# EasyEDA Pro project keyboard_board_schematic.epro

# Schematic Keyboard_schem
Board Name: Palmanac_keyboard; Create Date: 2025-07-08; Page Name: Palmanac; Project Name: Palmanac; Schematic Name: Keyboard_schem; Update Date: 2025-07-22; File: Palmanac; Id: /; Sheet: /
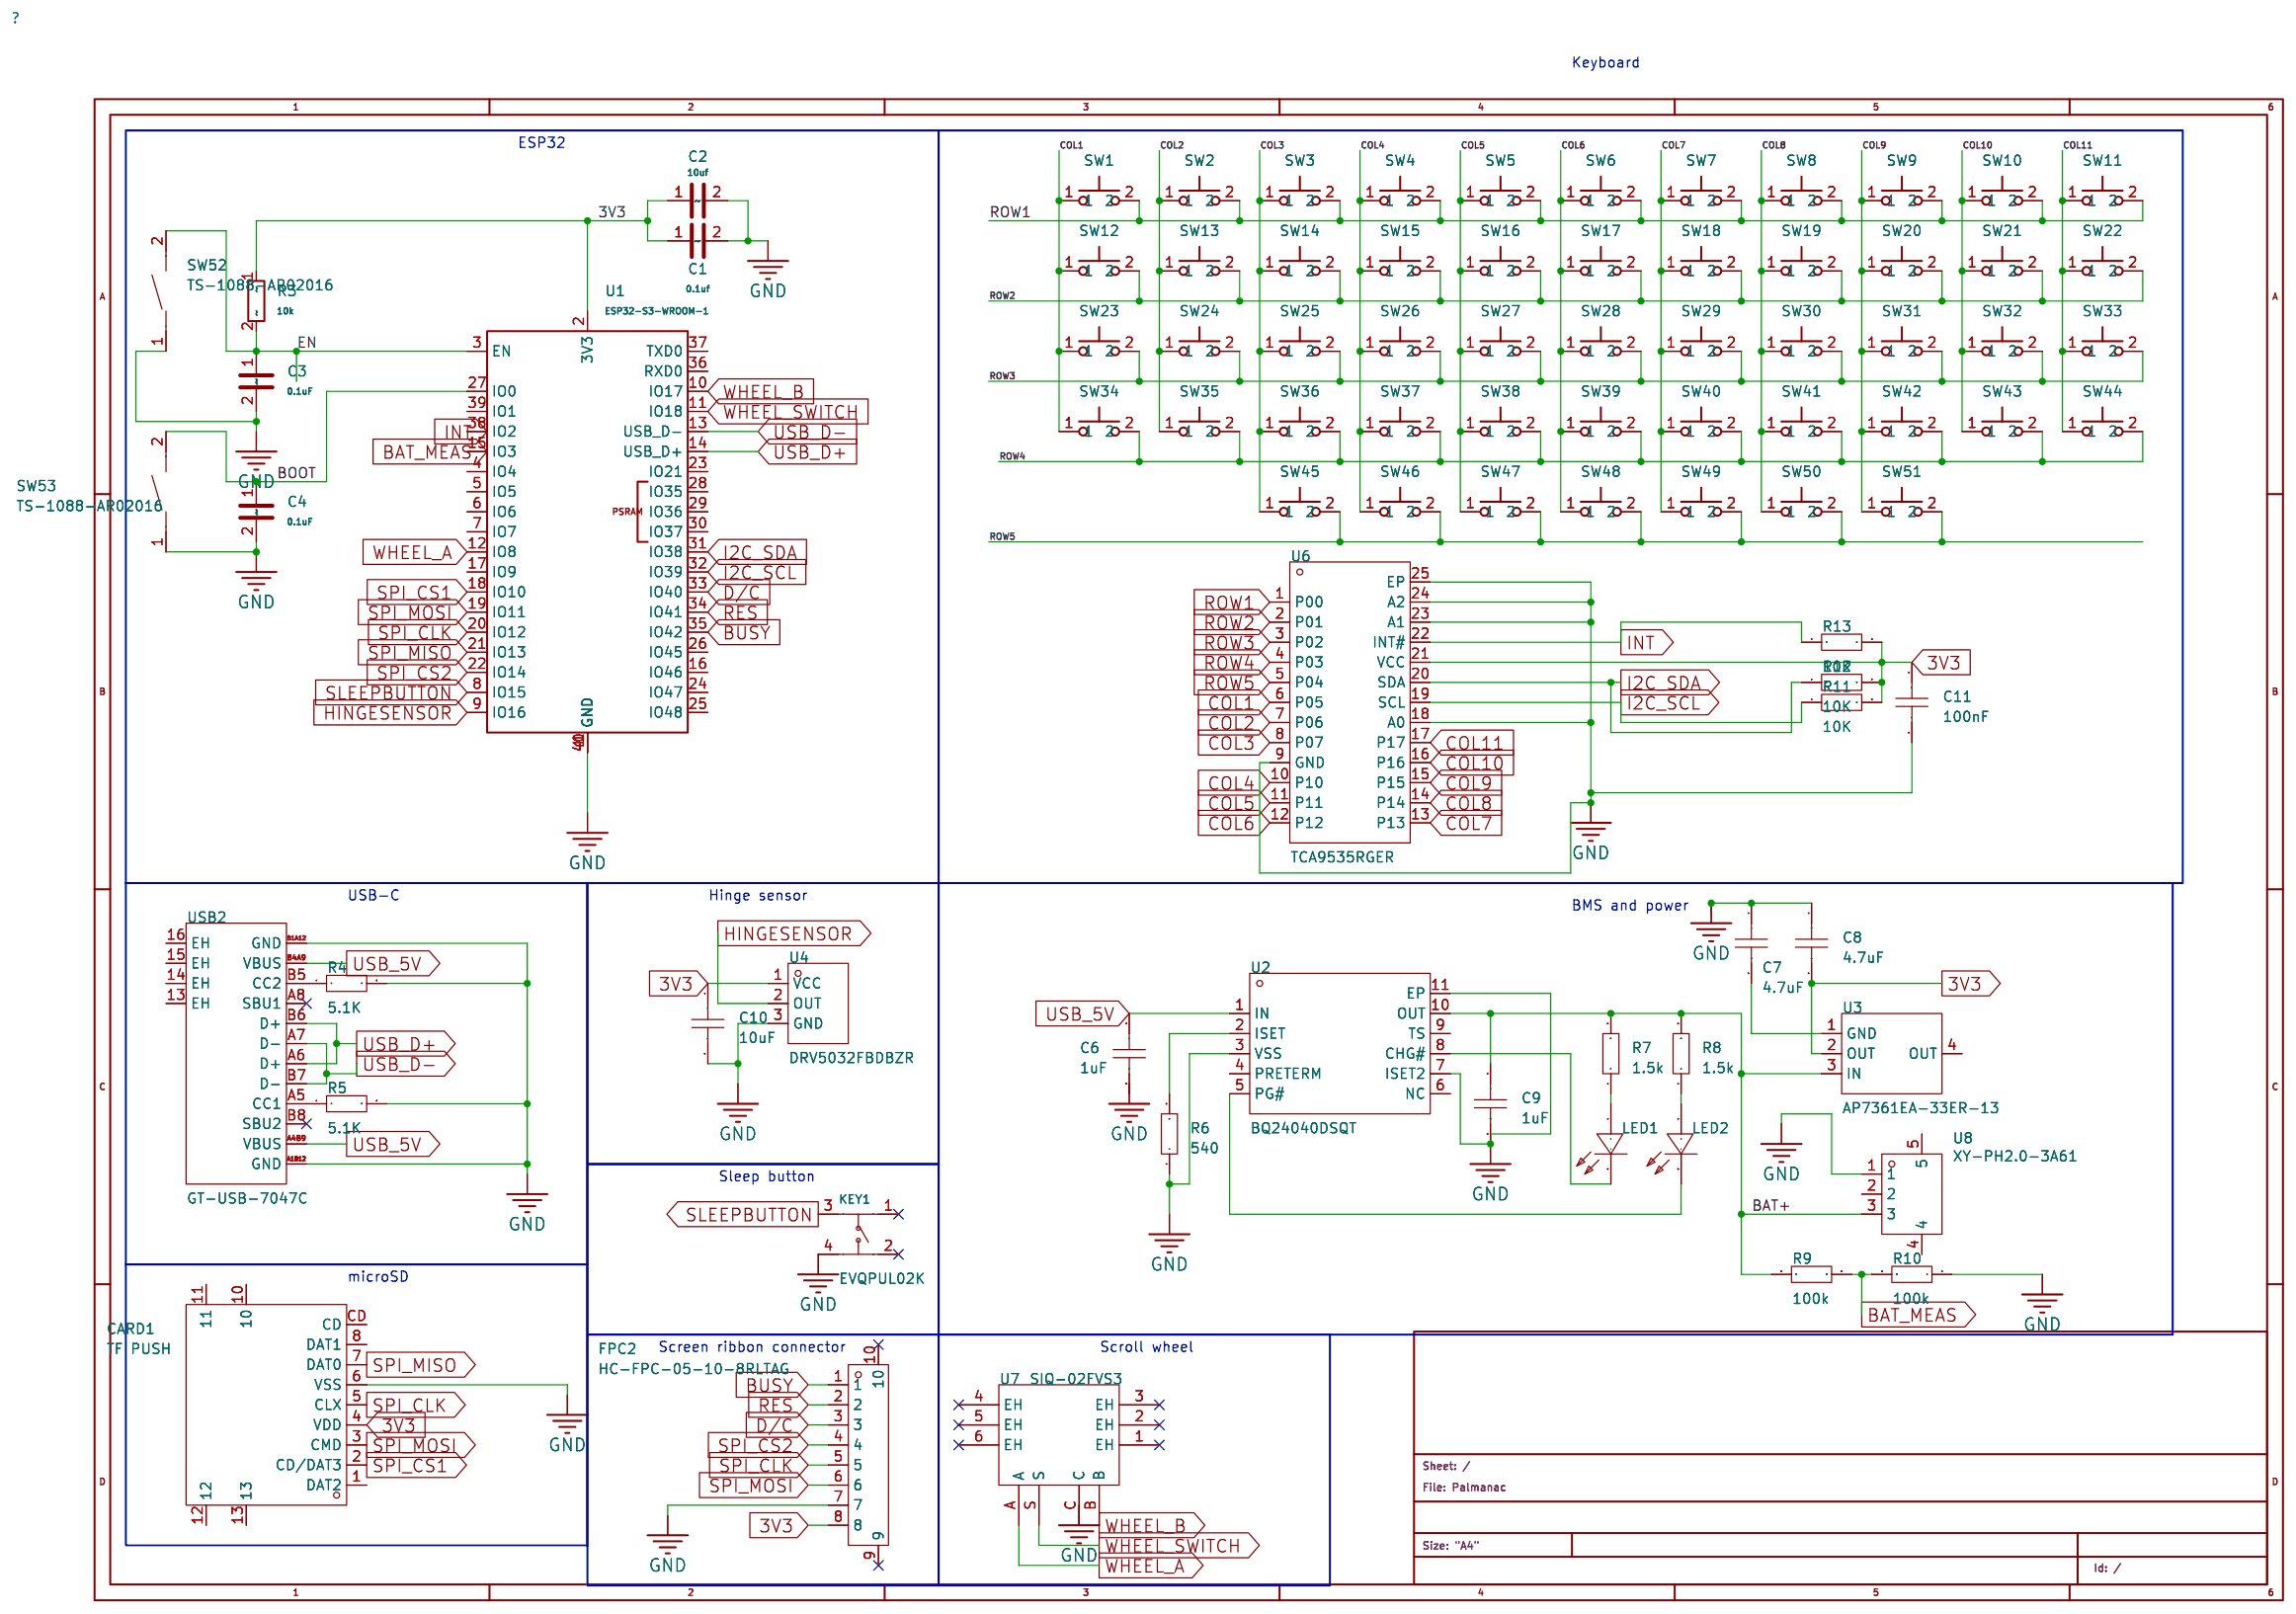
[diagram p0: schematic sheet]

## Parts
C1  0.1uf  [C0603]
C2  10uf  [C0603]
C3  0.1uF  [C0603]
C4  0.1uF  [C0603]
C6  1uF  [C0603]
C7  4.7uF  [C0603]
C8  4.7uF  [C0603]
C9  1uF  [C0603]
C10  10uF  [C0603]
C11  100nF  [C0603]
CARD1  TF PUSH  [TF-SMD_TF-PUSH]
FPC2  HC-FPC-05-10-8RLTAG  [FPC-SMD_8P-P0.50_HCTL_HC-FPC-05-10-8RLTAG]
KEY1  EVQPUL02K  [KEY-SMD_4P-L4.7-W3.5-P1.70-LS6.4-EH]
LED1  NCD0805R1  [LED0805-R-RD]
LED2  NCD0805R1  [LED0805-R-RD]
R3  10k  [R0603]
R4  5.1K  [R0603]
R5  5.1K  [R0603]
R6  540  [R0603]
R7  1.5k  [R0603]
R8  1.5k  [R0603]
R9  100k  [R0603]
R10  100k  [R0603]
R11  10K  [R0603]
R12  10K  [R0603]
R13  10K  [R0603]
SW1  SW_Push  [Switch_Dome_7MM]
SW2  SW_Push  [Switch_Dome_7MM]
SW3  SW_Push  [Switch_Dome_7MM]
SW4  SW_Push  [Switch_Dome_7MM]
SW5  SW_Push  [Switch_Dome_7MM]
SW6  SW_Push  [Switch_Dome_7MM]
SW7  SW_Push  [Switch_Dome_7MM]
SW8  SW_Push  [Switch_Dome_7MM]
SW9  SW_Push  [Switch_Dome_7MM]
SW10  SW_Push  [Switch_Dome_7MM]
SW11  SW_Push  [Switch_Dome_7MM]
SW12  SW_Push  [Switch_Dome_7MM]
SW13  SW_Push  [Switch_Dome_7MM]
SW14  SW_Push  [Switch_Dome_7MM]
SW15  SW_Push  [Switch_Dome_7MM]
SW16  SW_Push  [Switch_Dome_7MM]
SW17  SW_Push  [Switch_Dome_7MM]
SW18  SW_Push  [Switch_Dome_7MM]
SW19  SW_Push  [Switch_Dome_7MM]
SW20  SW_Push  [Switch_Dome_7MM]
SW21  SW_Push  [Switch_Dome_7MM]
SW22  SW_Push  [Switch_Dome_7MM]
SW23  SW_Push  [Switch_Dome_7MM]
SW24  SW_Push  [Switch_Dome_7MM]
SW25  SW_Push  [Switch_Dome_7MM]
SW26  SW_Push  [Switch_Dome_7MM]
SW27  SW_Push  [Switch_Dome_7MM]
SW28  SW_Push  [Switch_Dome_7MM]
SW29  SW_Push  [Switch_Dome_7MM]
SW30  SW_Push  [Switch_Dome_7MM]
SW31  SW_Push  [Switch_Dome_7MM]
SW32  SW_Push  [Switch_Dome_7MM]
SW33  SW_Push  [Switch_Dome_7MM]
SW34  SW_Push  [Switch_Dome_7MM]
SW35  SW_Push  [Switch_Dome_7MM]
SW36  SW_Push  [Switch_Dome_7MM]
SW37  SW_Push  [Switch_Dome_7MM]
SW38  SW_Push  [Switch_Dome_7MM]
SW39  SW_Push  [Switch_Dome_7MM]
SW40  SW_Push  [Switch_Dome_7MM]
SW41  SW_Push  [Switch_Dome_7MM]
SW42  SW_Push  [Switch_Dome_7MM]
SW43  SW_Push  [Switch_Dome_7MM]
SW44  SW_Push  [Switch_Dome_7MM]
SW45  SW_Push  [Switch_Dome_7MM]
SW46  SW_Push  [Switch_Dome_7MM]
SW47  SW_Push  [Switch_Dome_7MM]
SW48  SW_Push  [Switch_Dome_7MM]
SW49  SW_Push  [Switch_Dome_7MM]
SW50  SW_Push  [Switch_Dome_7MM]
SW51  SW_Push  [Switch_Dome_7MM]
SW52  TS-1088-AR02016  [SW-SMD_L3.9-W3.0-P4.45]
SW53  TS-1088-AR02016  [SW-SMD_L3.9-W3.0-P4.45]
U1  ESP32-S3-WROOM-1  [WIFIM-SMD_ESP32-S3-WROOM-1-N8]
U2  BQ24040DSQT  [WSON-10_L2.0-W2.0-P0.40-TL-EP]
U3  AP7361EA-33ER-13  [SOT-223-4_L6.5-W3.5-P2.30-LS7.0-BR]
U4  DRV5032FBDBZR  [SOT-23_L2.9-W1.3-P1.90-LS2.4-BR]
U6  TCA9535RGER  [VQFN-24_L4.0-W4.0-P0.50-BL-EP2.5]
U7  SIQ-02FVS3  [SW-SMD_SIQ-02FVS3_1]
U8  XY-PH2.0-3A61  [CONN-SMD_3P-P2.00_HX-2.0-3P-WT]
USB2  GT-USB-7047C  [USB-C-SMD_GT-USB-7047C]

## Library data of the parts
C1-C4 = Device_C: Unpolarized capacitor
C6-C11 = CAP_0603: Supplier Footprint: 0603
CARD1 = TF PUSH: Card Connection Mode:Self-bouncing Card Type:MicroSD card (TF card) Connector Type:Card Slot Additional Card Detection Pins:None Supplementary Features:- Maximum Body Height:2mm Operating Temperature Range:-20℃~+90℃ Operating Temperature Range:-20℃~+90℃; LCSC Part Name: 自弹式 MicroSD卡(TF卡) 卡座; Supplier Part: C393941; Manufacturer: SHOU HAN(首韩); Supplier Footprint: SMD; JLCPCB Part Class: Extended Part; Datasheet: https://atta.szlcsc.com/upload/public/pdf/source/20191011/C393941_0DDD896EE907FEB750D8B7B8982E2A67.pdf; Supplier: LCSC; Card Connection Mode: Self-bouncing; Card Type: MicroSD card (TF card); Connector Type: Card Slot; Additional Card Detection Pins: None; Maximum Body Height: 2mm; Operating Temperature Range: -20℃~+90℃
FPC2 = HC-FPC-05-10-8RLTAG: Locking Feature:Clamshell Contact Type:Bottom Contact Number of Contacts:8P Pitch:0.5mm Mounting Type:卧贴 FFC, FCB Thickness:0.3mm FFC, FCB Thickness:0.3mm Height Above Board:1mm Contact Material:Copper Alloy Operating Temperature Range:-55℃~+85℃ Operating; LCSC Part Name: 翻盖式 下接 P数:8P 间距:0.5mm; Supplier Part: C5213730; Manufacturer: HCTL(华灿天禄); Supplier Footprint: SMD,P=0.5mm,卧贴; JLCPCB Part Class: Extended Part; Datasheet: https://atta.szlcsc.com/upload/public/pdf/source/20221027/B2DE489DA152049D1F105170189CFB4E.pdf; Supplier: LCSC; Locking Feature: Clamshell; Contact Type: Bottom Contact; Number of Contacts: 8P; Pitch: 0.5mm; Mounting Type: 卧贴; FFC, FCB Thickness: 0.3mm; Height Above Board: 1mm; Contact Material: Copper Alloy; Operating Temperature Range: -55℃~+85℃
KEY1 = EVQPUL02K: Circuit:SPST Actuator Style:Rectangle button Operating Force:1.6N Mounting Style:卧贴 Switch Length:4.7mm Switch Width:4.5mm Switch Height:1.65mm Contact Current:50mA Voltage Rating (AC):- Voltage Rating (DC):12V Power Rating:- Insulation Resistance:100MΩ W; LCSC Part Name: 4.7*4.5*1.65mm 卧贴 轻触开关; Supplier Part: C79175; Manufacturer: PANASONIC(松下); Supplier Footprint: SMD,4.5x4.7mm; JLCPCB Part Class: Extended Part; Datasheet: https://atta.szlcsc.com/upload/public/pdf/source/20170824/C128539_1503566139783907465.pdf; Supplier: LCSC; Circuit: SPST; Actuator Style: Rectangle button; Operating Force: 1.6N; Mounting Style: 卧贴; Switch Length: 4.7mm; Switch Width: 4.5mm; Switch Height: 1.65mm; Contact Current: 50mA; Voltage Rating (DC): 12V; Insulation Resistance: 100MΩ; Pin Style: Solder Lug; Mechanical Life: 10万次; Operating Temperature: -20℃~+70℃
LED1 LED2 = NCD0805R1_C84256: Lamp Holder Type:- Emitted Color:Red Forward Voltage (VF):1.6V~2.6V Forward Voltage (VF):1.6V~2.6V Power Dissipation:65mW Forward Current:20mA Dominant Wavelength:615nm~630nm Dominant Wavelength:615nm~630nm Peak Wavelength:- Diode Configuration:独立二极管 Lens; Supplier Part: C84256; Manufacturer: 国星光电; Supplier Footprint: 0805; JLCPCB Part Class: Basic Part; Datasheet: https://atta.szlcsc.com/upload/public/pdf/source/20200820/C84256_F0A75A43B3EAD75808600A0514C76B99.pdf; Supplier: LCSC; Emitted Color: Red; Forward Voltage (VF): 1.6V~2.6V; Power Dissipation: 65mW; Forward Current: 20mA; Dominant Wavelength: 615nm~630nm; Diode Configuration: 独立二极管; Lens Color: 无色透明透镜; Luminous Intensity: 67mcd~195mcd; Viewing Angle: 130°; Operating Temperature: -30℃~+85℃
R3 = Device_R: Resistor
R4-R13 = Res_0603: Supplier Footprint: 0603
SW1-SW51 = Switch_SW_Push: Push button switch, generic, two pins
SW52 SW53 = TS-1088-AR02016: Circuit:SPST Actuator Style:Round Button Operating Force:160gf Mounting Style:Brick nogging Switch Length:4mm Switch Width:3mm Switch Height:2mm Strike Gundam:不带 Contact Current:50mA Voltage Rating (DC):12V Insulation Resistance:100MΩ Actuator/Cap Color:B; LCSC Part Name: 4*3*2mm 立贴 轻触开关; Supplier Part: C720477; Manufacturer: XUNPU(讯普); Supplier Footprint: SMD; JLCPCB Part Class: Basic Part; Datasheet: https://atta.szlcsc.com/upload/public/pdf/source/20200810/C720475_60D09DD6C54279ADDB2DC25100F1CC11.pdf; Supplier: LCSC; Circuit: SPST; Actuator Style: Round Button; Operating Force: 160gf; Mounting Style: Brick nogging; Switch Length: 4mm; Switch Width: 3mm; Switch Height: 2mm; Strike Gundam: 不带; Contact Current: 50mA; Voltage Rating (DC): 12V; Insulation Resistance: 100MΩ; Actuator/Cap Color: Black; Pin Style: SMDSplicing; Mechanical Life: 10万次; Operating Temperature: -30℃~+80℃
U1 = RF_Module_ESP32-S3-WROOM-1: RF Module, ESP32-S3 SoC, Wi-Fi 802.11b/g/n, Bluetooth, BLE, 32-bit, 3.3V, onboard antenna, SMD; User doc link: https://www.espressif.com/sites/default/files/documentation/esp32-s3-wroom-1_wroom-1u_datasheet_en.pdf
U2 = BQ24040DSQT: LCSC Part Name: 具有自动启动功能的单输入单节锂离子和锂聚合物电池充电器; Supplier Part: C2876332; Manufacturer: TI(德州仪器); Supplier Footprint: WSON-10-EP(2x2); JLCPCB Part Class: Extended Part; Datasheet: https://www.ti.com/cn/lit/gpn/bq24040; Supplier: LCSC
U3 = AP7361EA-33ER-13: Output Type:Fixed Voltage - Supply:6V Output Voltage:3.3V Output Voltage:3.3V Output Current:1A Power Supply Rejection Ratio (PSRR):75dB Voltage Dropout:360mV@(1A) standby current:68uA Noise:- Features:Over Current Protection Operating Temperature:-40℃~+8; Supplier Part: C7076973; Manufacturer: DIODES(美台); Supplier Footprint: SOT-223R; JLCPCB Part Class: Extended Part; Datasheet: https://atta.szlcsc.com/upload/public/pdf/source/231023/AP7361EA-0840c6799e7422d3a1325458121d13db.pdf; Supplier: LCSC; Output Type: Fixed; Voltage - Supply: 6V; Output Voltage: 3.3V; Output Current: 1A; Power Supply Rejection Ratio (PSRR): 75dB; Voltage Dropout: 360mV@(1A); standby current: 68uA; Features: Over Current Protection; Operating Temperature: -40℃~+85℃@(Ta); Output Configuration: Positive; Number of Outputs: 1
U4 = DRV5032FBDBZR: LCSC Part Name: 数字锁存霍尔效应传感器; Supplier Part: C2655033; Manufacturer: TI(德州仪器); Supplier Footprint: SOT-23; JLCPCB Part Class: Extended Part; Datasheet: https://www.ti.com/cn/lit/gpn/drv5032; Supplier: LCSC
U6 = TCA9535RGER: Interface:I2C；SMBus Number of I/O:16 Interrupt Output:With Interrupt Output Output Type:- Voltage - Supply:1.65V~5.5V Voltage - Supply:1.65V~5.5V Current - Output Low(IOL):- Current - Output High(IOH):- Clock Frequency:400kHz Operating Temperature:-40℃~+8; LCSC Part Name: TCA9535 低电压16位 I²C 和 SMBus 低功耗 I/O 扩展器; Supplier Part: C527428; Manufacturer: TI(德州仪器); Supplier Footprint: VQFN-24-EP(4x4); JLCPCB Part Class: Extended Part; Datasheet: https://www.ti.com/cn/lit/gpn/tca9535; Supplier: LCSC; Interface: I2C；SMBus; Number of I/O: 16; Interrupt Output: With Interrupt Output; Voltage - Supply: 1.65V~5.5V; Clock Frequency: 400kHz; Operating Temperature: -40℃~+85℃
U7 = SIQ-02FVS3: LCSC Part Name: 拨轮滚轮旋转编码器开关; Supplier Part: C2925423; Manufacturer: MITSUMI(美上美); Supplier Footprint: SMD; JLCPCB Part Class: Extended Part; Datasheet: https://atta.szlcsc.com/upload/public/pdf/source/20220728/2FBC1A98A06DC86460FC69DAE20456FC.pdf; Supplier: LCSC
U8 = XY-PH2.0-3A61: Pins Structure:1x3P Pitch:2mm Mounting Style:Horizontal attachment Number of Pins:3P Number of Rows:1 Number of PINs Per Row:3; LCSC Part Name: 间距:2.0mm 1x3P 卧贴; Supplier Part: C19272096; Manufacturer: XYECONN(辛译); Supplier Footprint: SMD,P=2mm,卧贴; JLCPCB Part Class: Extended Part; Datasheet: https://atta.szlcsc.com/upload/public/pdf/source/20231128/F1F74D25EE41EDF9A689EFC57C64BCC7.pdf; Supplier: LCSC; Pins Structure: 1x3P; Pitch: 2mm; Mounting Style: Horizontal attachment; Number of Pins: 3P; Number of Rows: 1; Number of PINs Per Row: 3
USB2 = GT-USB-7047C: Connector Type:Type-C Protocol Standard:USB 2.0 Gender:Female Mounting Type:Surface Mount Number of Contacts:16P Number of Ports:1 Current Rating-Power:5A Voltage Rating:24V Connect-Disconnect Life:10,000 times Center Height:1.58mm Length:7.35mm Detection; LCSC Part Name: Type-C 母 卧贴; Supplier Part: C963218; Manufacturer: G-Switch(品赞); Supplier Footprint: SMD; JLCPCB Part Class: Extended Part; Datasheet: https://atta.szlcsc.com/upload/public/pdf/source/20231219/4474A8239E3B85EED111863085E50575.pdf; Supplier: LCSC; Connector Type: Type-C; Protocol Standard: USB 2.0; Gender: Female; Mounting Type: Surface Mount; Number of Contacts: 16P; Number of Ports: 1; Current Rating-Power: 5A; Voltage Rating: 24V; Connect-Disconnect Life: 10,000 times; Center Height: 1.58mm; Length: 7.35mm; Detection color: Black; Operating Temperature: -40℃~+85℃

## Nets
3V3: C1.1 C2.1 C8.2 C10.1 C11.1 CARD1.4(VDD) FPC2.8 R3.1 R11.2 R12.2 R13.2 U1.2(3V3) U3.2(OUT) U4.1(VCC) U6.21(VCC)
GND: C1.2 C2.2 C3.2 C4.2 C6.2 C7.1 C8.1 C9.2 C10.2 C11.2 CARD1.6(VSS) FPC2.7 KEY1.4 R4.2 R5.2 R6.1 R10.1 SW52.1 SW53.1 U1.1(GND) U1.40(GND) U1.41(GND) U2.3(VSS) U2.7(ISET2) U2.11(EP) U4.3(GND) U6.9(GND) U6.18(A0) U6.23(A1) U6.24(A2) U6.25(EP) U7.C U8.1 USB2.A1B12(GND) USB2.B1A12(GND)
BAT+: C9.1 R7.2 R8.2 R9.2 U2.10(OUT) U3.3(IN) U8.3
BAT_MEAS: R9.1 R10.2 U1.15(IO3)
BOOT: C4.1 SW53.2 U1.27(IO0)
BUSY: FPC2.1 U1.35(IO42)
COL1: SW1.1 SW12.1 SW23.1 SW34.1 U6.6(P05)
COL2: SW2.1 SW13.1 SW24.1 SW35.1 U6.7(P06)
COL3: SW3.1 SW14.1 SW25.1 SW36.1 SW45.1 U6.8(P07)
COL4: SW4.1 SW15.1 SW26.1 SW37.1 SW46.1 U6.10(P10)
COL5: SW5.1 SW16.1 SW27.1 SW38.1 SW47.1 U6.11(P11)
COL6: SW6.1 SW17.1 SW28.1 SW39.1 SW48.1 U6.12(P12)
COL7: SW7.1 SW18.1 SW29.1 SW40.1 SW49.1 U6.13(P13)
COL8: SW8.1 SW19.1 SW30.1 SW41.1 SW50.1 U6.14(P14)
COL9: SW9.1 SW20.1 SW31.1 SW42.1 SW51.1 U6.15(P15)
COL10: SW10.1 SW21.1 SW32.1 SW43.1 U6.16(P16)
COL11: SW11.1 SW22.1 SW33.1 SW44.1 U6.17(P17)
D/C: FPC2.3 U1.33(IO40)
EN: C3.1 R3.2 SW52.2 U1.3(EN)
HINGESENSOR: U1.9(IO16) U4.2(OUT)
I2C_SCL: R11.1 U1.32(IO39) U6.19(SCL)
I2C_SDA: R12.1 U1.31(IO38) U6.20(SDA)
INT: R13.1 U1.38(IO2) U6.22(INT#)
RES: FPC2.2 U1.34(IO41)
ROW1: SW1.2 SW2.2 SW3.2 SW4.2 SW5.2 SW6.2 SW7.2 SW8.2 SW9.2 SW10.2 SW11.2 U6.1(P00)
ROW2: SW12.2 SW13.2 SW14.2 SW15.2 SW16.2 SW17.2 SW18.2 SW19.2 SW20.2 SW21.2 SW22.2 U6.2(P01)
ROW3: SW23.2 SW24.2 SW25.2 SW26.2 SW27.2 SW28.2 SW29.2 SW30.2 SW31.2 SW32.2 SW33.2 U6.3(P02)
ROW4: SW34.2 SW35.2 SW36.2 SW37.2 SW38.2 SW39.2 SW40.2 SW41.2 SW42.2 SW43.2 SW44.2 U6.4(P03)
ROW5: SW45.2 SW46.2 SW47.2 SW48.2 SW49.2 SW50.2 SW51.2 U6.5(P04)
SLEEPBUTTON: KEY1.3 U1.8(IO15)
SPI_CLK: CARD1.5(CLX) FPC2.5 U1.20(IO12)
SPI_CS1: CARD1.2(CD/DAT3) U1.18(IO10)
SPI_CS2: FPC2.4 U1.22(IO14)
SPI_MISO: CARD1.7(DAT0) U1.21(IO13)
SPI_MOSI: CARD1.3(CMD) FPC2.6 U1.19(IO11)
USB_5V: C6.1 U2.1(IN) USB2.A4B9(VBUS) USB2.B4A9(VBUS)
USB_D+: U1.14(USB_D+) USB2.A6(D+) USB2.B6(D+)
USB_D-: U1.13(USB_D-) USB2.A7(D-) USB2.B7(D-)
WHEEL_A: U1.12(IO8) U7.A
WHEEL_B: U1.10(IO17) U7.B
WHEEL_SWITCH: U1.11(IO18) U7.S
Net-(C7-2): C7.2 U3.1(GND)
Net-(LED1-1): LED1.1(+) R7.1
Net-(LED1-2): LED1.2(-) U2.8(CHG#)
Net-(LED2-1): LED2.1(+) R8.1
Net-(LED2-2): LED2.2(-) U2.5(PG#)
Net-(R4-1): R4.1 USB2.B5(CC2)
Net-(R5-1): R5.1 USB2.A5(CC1)
Net-(R6-2): R6.2 U2.2(ISET)

Not connected (* = marked no-connect by the designer): CARD1 1(DAT2) 8(DAT1) 10 11 12 13 CD; FPC2 9* 10*; KEY1 1* 2*; U1 4(IO4) 5(IO5) 6(IO6) 7(IO7) 16(IO46) 17(IO9) 23(IO21) 24(IO47) 25(IO48) 26(IO45) 28(IO35) 29(IO36) 30(IO37) 36(RXD0) 37(TXD0) 39(IO1); U2 4(PRETERM) 6(NC) 9(TS); U3 4(OUT); U7 1(EH)* 2(EH)* 3(EH)* 4(EH)* 5(EH)* 6(EH)*; U8 2 4 5; USB2 13(EH) 14(EH) 15(EH) 16(EH) A8(SBU1)* B8(SBU2)*

## Notes on the sheet
- Keyboard
- ESP32
- USB-C
- Hinge sensor
- BMS and power
- Sleep button
- microSD
- Screen ribbon connector
- Scroll wheel
